# Altium schematic sheet SensorControl_Board_v3.1.SchDoc
size A
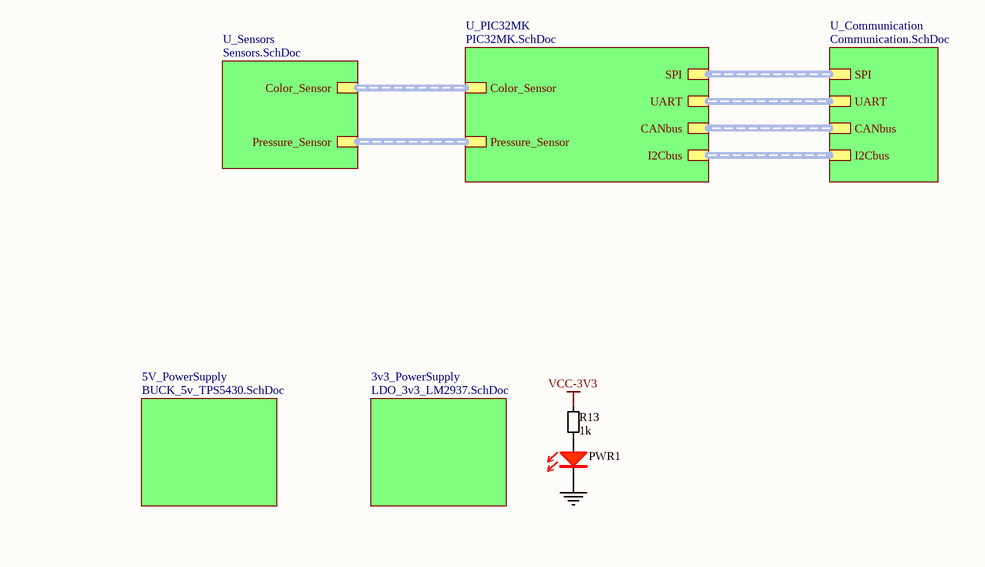
[diagram p0: SensorControl_Board_v3.1.SchDoc]

## Parts
PWR1  LED RED  [LED_RED_0805]  (value not drawn)
R13  1k  [RESC2013X38N-0805-NOOVERLAY]

## Sub-sheets
3v3_PowerSupply = LDO_3v3_LM2937.SchDoc: no entries
5V_PowerSupply = BUCK_5v_TPS5430.SchDoc: no entries
U_Communication = Communication.SchDoc: SPI (harness SPI), UART (harness UART), CANbus (harness CANbus), I2Cbus (harness I2Cbus)
U_PIC32MK = PIC32MK.SchDoc: Color_Sensor (harness Color_Sensor), Pressure_Sensor (harness Pressure_Sensor), SPI (harness SPI), UART (harness UART), CANbus (harness CANbus), I2Cbus (harness I2Cbus)
U_Sensors = Sensors.SchDoc: Color_Sensor (harness Color_Sensor), Pressure_Sensor (harness Pressure_Sensor)

## Nets
GND: PWR1.1(C)
VCC-3V3: R13.2
NetPWR1_2: PWR1.2(A) R13.1

## Buses and harness runs
harness sheet U_Communication/CANbus = sheet U_PIC32MK/CANbus
harness sheet U_Communication/I2Cbus = sheet U_PIC32MK/I2Cbus
harness sheet U_Communication/SPI = sheet U_PIC32MK/SPI
harness sheet U_Communication/UART = sheet U_PIC32MK/UART
harness sheet U_PIC32MK/Color_Sensor = sheet U_Sensors/Color_Sensor
harness sheet U_PIC32MK/Pressure_Sensor = sheet U_Sensors/Pressure_Sensor

## Library data of the parts
PWR1 = LED_RED_0805: LED RED 0805; Manufacturer: BRIGHT LED ELECTRONICS; Manufacturer Part Number: BL-HUB35A-AV-TRB; Barcode: 2911010024321; id: 35; Assembly: SMD; Voltage Forward: 2.0 V; item_id: 3341; Recommended Rating: Platinum; Package Case: 0805 (2012 Metric); Color: Red; Family: LED; Part Type: Optoelectronics
R13 = 00001001: RES SMD 1 kOhm 1/8W 0805; Power: 0.125W, 1/8W; Barcode: 00009101; Resistance: 1k; Assembly: SMD